# Altium project ModemMate.PrjPcb
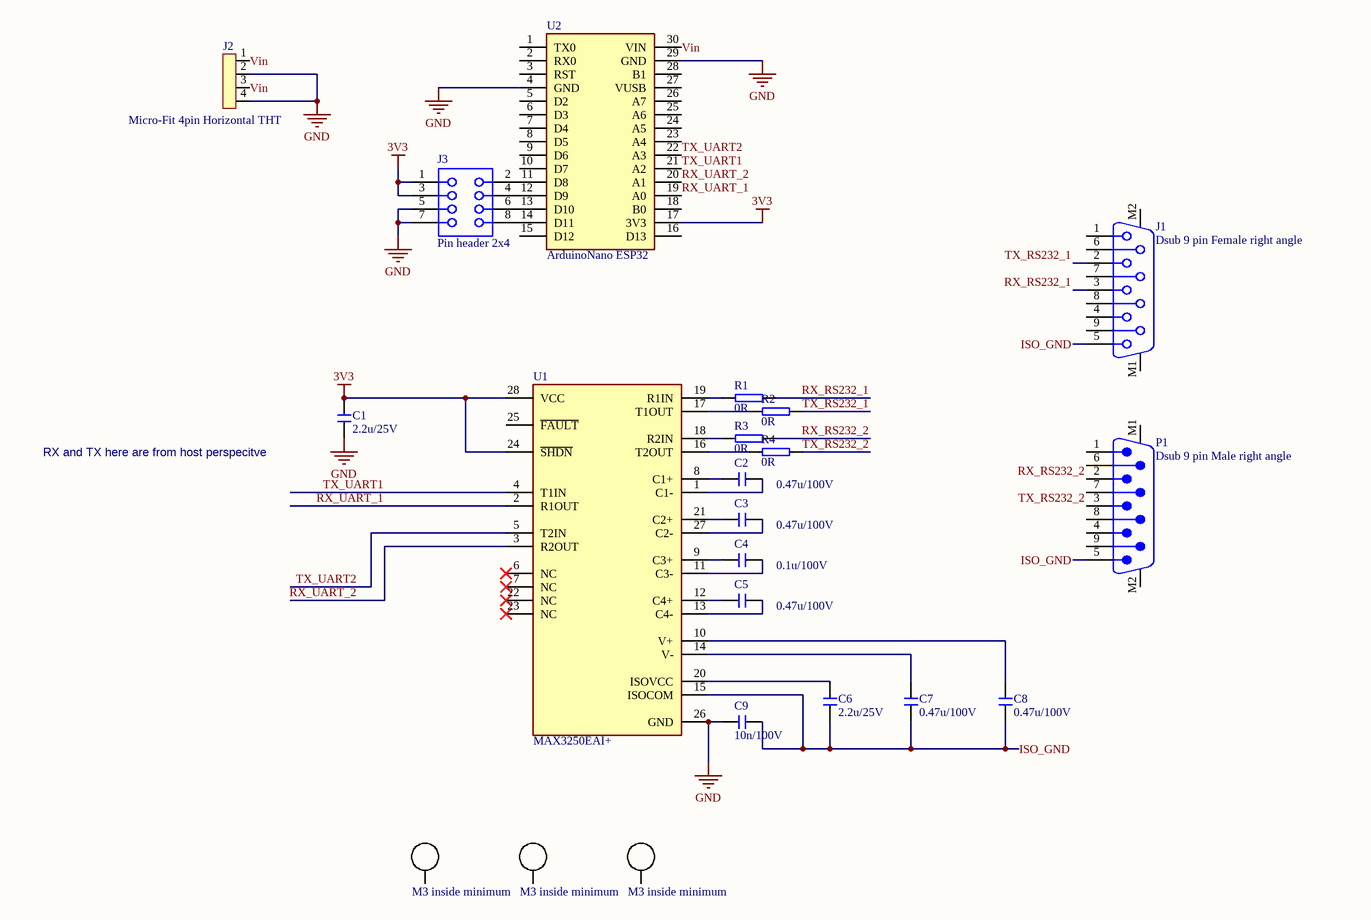
[diagram p0: ModemMate.SchDoc]
ViaType: Type I: Tented, Type IV-b: Plugged and covered, Type VII: Filled and capped; ViaFillType: NA, Epoxy, Copper, Thermally conductive or Other; SurfaceFinish: ENIG, Lead-Free HASL, Immersion silver or Other; SpecifiedStackup: Yes, No; SolderStopTop: Any, Green, White, Black, Blue, Yellow, Red or Other; SolderStopBottom: Any, Green, White, Black, Blue, Yellow, Red or Other; SilkprintTop: Any, Green, White, Black, Blue, Yellow, Red or Other; SilkprintBottom: Any, Green, White, Black, Blue, Yellow, Red or Other; ProjectName: ModemMate; ControlledImpedance: No
1 sheet, 22 parts. Net scope: global (net labels, ports and power ports of the same name join across sheets).
Board file: ModemMate.PcbDoc

## Sheet ModemMate.SchDoc: Change me to something descriptive
size A3; DocumentNumber: ModemMate; SheetNumber: 1; SheetTotal: 1

### Parts
B1  M3 inside minimum  [M3 minimum]  (no BOM)
B2  M3 inside minimum  [M3 minimum]  (no BOM)
B3  M3 inside minimum  [M3 minimum]  (no BOM)
C1  2.2u/25V  [C0805]
C2  0.47u/100V  [C0805]
C3  0.47u/100V  [C0805]
C4  0.1u/100V  [C0603]
C5  0.47u/100V  [C0805]
C6  2.2u/25V  [C0805]
C7  0.47u/100V  [C0805]
C8  0.47u/100V  [C0805]
C9  10n/100V  [C0603]
J1  Dsub 9 pin Female right angle  [618009231321]
J2  Micro-Fit 4pin Horizontal THT  [43045-0400]
J3  Pin header 2x4  [61300821821]
P1  Dsub 9 pin Male right angle  [618009231221]
R1  0R  [R0603]
R2  0R  [R0603]
R3  0R  [R0603]
R4  0R  [R0603]
U1  MAX3250EAI+  [SSOP-28P, no-thermal]
U2  ArduinoNano ESP32  [Copy of New footprint 1]

### Nets
3V3: C1.1 J3.1 J3.3 U1.24(~{SHDN}) U1.28(VCC) U2.17(3V3)
GND: C1.2 C9.2 J2.2 J2.4 J3.5 J3.7 U1.26(GND) U2.4(GND) U2.29(GND)
ISO_GND: C6.2 C7.2 C8.2 C9.1 J1.5 P1.5 U1.15(ISOCOM)
RX_RS232_1: J1.3 R1.1
RX_RS232_2: P1.2 R3.1
RX_UART_1: U1.2(R1OUT) U2.19(A0)
RX_UART_2: U1.3(R2OUT) U2.20(A1)
TX_RS232_1: J1.2 R2.1
TX_RS232_2: P1.3 R4.1
TX_UART1: U1.4(T1IN) U2.21(A2)
TX_UART2: U1.5(T2IN) U2.22(A3)
Vin: J2.1 J2.3 U2.30(VIN)
NetC2_1: C2.1 U1.8(C1+)
NetC2_2: C2.2 U1.1(C1-)
NetC3_1: C3.1 U1.21(C2+)
NetC3_2: C3.2 U1.27(C2-)
NetC4_1: C4.1 U1.9(C3+)
NetC4_2: C4.2 U1.11(C3-)
NetC5_1: C5.1 U1.12(C4+)
NetC5_2: C5.2 U1.13(C4-)
NetC6_1: C6.1 U1.20(ISOVCC)
NetC7_1: C7.1 U1.14(V-)
NetC8_1: C8.1 U1.10(V+)
NetJ3_2: J3.2 U2.11(D8)
NetJ3_4: J3.4 U2.12(D9)
NetJ3_6: J3.6 U2.13(D10)
NetJ3_8: J3.8 U2.14(D11)
NetR1_2: R1.2 U1.19(R1IN)
NetR2_2: R2.2 U1.17(T1OUT)
NetR3_2: R3.2 U1.18(R2IN)
NetR4_2: R4.2 U1.16(T2OUT)

Not connected (* = marked no-connect by the designer): B1 1; B2 1; B3 1; J1 1 4 6 7 8 9 M1 M2; P1 1 4 6 7 8 9 M1 M2; U1 6(NC)* 7(NC)* 22(NC)* 23(NC)* 25(~{FAULT}); U2 1(TX0) 2(RX0) 3(RST) 5(D2) 6(D3) 7(D4) 8(D5) 9(D6) 10(D7) 15(D12) 16(D13) 18(B0) 23(A4) 24(A5) 25(A6) 26(A7) 27(VUSB) 28(B1)

### Notes on the sheet
- RX and TX here are from host perspecitve
- Title
- Customer:
- Size
- Date:
- A3
- Project
- Variant
- Sheet         of
- Revision
- File:
- Drawn by:

### Library data of the parts
B1-B3 = CMP-00028-00013-3: smaller M3 mounting holde for inside the PCB. should not be used for nuts(tools will not fit); Case/Package: M3
C1 C6 = CMP-00124-3: 2.2µF, 25V, 0805; Tolerance: 10%; Dielectric: X7R; Voltage: 25V; Case/Package: 0805; Value: 2.2µF
C2 C3 C5 C7 C8 = CMP-001-00015-1: 0.47uF, 100V, 0805; Value: 470nF; Tolerance: 10%; Dielectric: Ceramic; Case/Package: 0805; Voltage: 100V
C4 = CMP-001-00000-2: 0.1μF, 100V, 0603; Tolerance: 10%; Value: 100nF; Dielectric: X7R; Case/Package: 0603; Voltage: 100V
C9 = CMP-00133-2: 10nF, 100V, 0603; Tolerance: 10%; Dielectric: X7R; Case/Package: 0603; Voltage: 100V; Value: 10nF
J1 = CMP-00660-1: 9 Way Right Angle Through Hole Pcb D-sub Connector Socket, 2.77MM, 2.84MM Pitch; Manufacturer: Wurth elektronik; Voltage Rating: 125V; Current Rating: 3A; Number of Positions: 9; Number of Rows: 2; Contact Plating: Gold; Mounting Angle: Right Angle; Mounting Style: Through Hole; Part name: 618009231321
J2 = CMP-002-00021-4: Rectangular Power Connector, 4 Contact(s), Male, Solder Terminal, Plug; Manufacturer: Molex; Current Rating: 8.5A; Mounting Angle: Right Angle; Number of Positions: 4; Voltage Rating: 250V; Number of Rows: 2; Part name: 43045-0400; Mounting Style: Through Hole; Contact Plating: Tin
J3 = CMP-00552-1: Board Connector, 8 Contact(s), 2 Row(s), Female, Straight, 0.1 inch Pitch, Solder Terminal, Locking, Black Insulator, Socket; Manufacturer: Wurth Elektronik; Current Rating: 3A; Number of Positions: 8; Mounting Angle: Vertical; Voltage Rating: 250V; Mounting Style: Through Hole; Contact Plating: Gold; Number of Rows: 2; Part name: 61300821821
P1 = CMP-00659-1: 9 Way Right Angle Through Hole Pcb D-sub Connector Plug, 2.77MM, 2.84MM Pitch; Manufacturer: Wurth Eletronik; Current Rating: 3A; Voltage Rating: 125V; Number of Positions: 9; Number of Rows: 2; Contact Plating: Gold; Mounting Style: Through Hole; Mounting Angle: Right Angle; Part name: 618009231221
R1-R4 = CMP-00047-3: Resistor 0R, 0603, 1%, SMD; Power: 100mW; Voltage: 75V; Value: 0; Tolerance: 1%; Case/Package: 0603
U1 = CMP-00252-2: isolated Line Transceiver, 2 Func, 2 Driver, 2 Rcvr, BICMOS, PDSO28; Manufacturer: Maxim; Min Supply Voltage: 3V; Max Supply Current: 35mA; Max Supply Voltage: 5.5V; Case/Package: SSOP 28; Min Operating Temperature: -40°C; Part name: MAX3250EAI+; Voltage Rating: 5.5V; Current Rating: 35mA
U2 = CMP-00661-1: Arduino nano development board; Current Rating: 25mA; Voltage Rating: 5V; Manufacturer: Arduino; Part name: Nano ESP32; Case/Package: Nano

## Assembly variants
Default: all parts fitted